# Altium schematic sheet eos26_scan_cable_adapter.SchDoc
size A
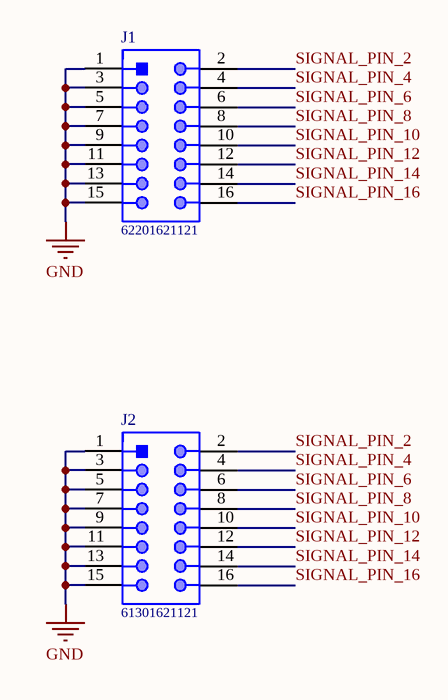
[diagram p0: eos26_scan_cable_adapter.SchDoc]

## Parts
J1  62201621121  [62201621121]
J2  61301621121  [61301621121]

## Nets
GND: J1.1 J1.3 J1.5 J1.7 J1.9 J1.11 J1.13 J1.15 J2.1 J2.3 J2.5 J2.7 J2.9 J2.11 J2.13 J2.15
SIGNAL_PIN_2: J1.2 J2.2
SIGNAL_PIN_4: J1.4 J2.4
SIGNAL_PIN_6: J1.6 J2.6
SIGNAL_PIN_8: J1.8 J2.8
SIGNAL_PIN_10: J1.10 J2.10
SIGNAL_PIN_12: J1.12 J2.12
SIGNAL_PIN_14: J1.14 J2.14
SIGNAL_PIN_16: J1.16 J2.16

## Library data of the parts
J1 = CMP-1502-00950-1: THT Vertical Pin Header WR-PHD, Pitch 1.27 mm, Dual Row, 16 pins; Manufacturer: Wurth Elektronik; Gender: Male; Working Voltage: 100VAC; Rated Current: 1A; Pin Number: 16; Pitch: 1.27mm; Contact Resistance: 20mOhm; Withstanding Voltage: 500VAC; Publisher: WurthElektronik; Package Reference: 62201621121; Part Number: 62201621121; Packaging: Box; Row Number: Dual; Mounting Technology: THT; Operating Temperature: -40to105degC; Manufacturer URL: http://www.we-online.de; Orientation: Vertical; Datasheet URL: https://katalog.we-online.de/em/datasheet/62201621121.pdf
J2 = CMP-1502-01097-1: THT Vertical Pin Header WR-PHD, Pitch 2.54 mm, Dual Row, 16 pins; Manufacturer: Wurth Elektronik; Gender: Male; Rated Current: 3A; Pitch: 2.54mm; Withstanding Voltage: 500VAC; Contact Resistance: 20mOhm; Working Voltage: 250VAC; Pin Number: 16; Mounting Technology: THT; Orientation: Vertical; Manufacturer URL: http://www.we-online.de; Row Number: Dual; Part Number: 61301621121; Datasheet URL: https://katalog.we-online.de/em/datasheet/6130xx21121.pdf; Packaging: Bag; Operating Temperature: -40to105degC; Publisher: WurthElektronik; Package Reference: 61301621121